# EasyEDA schematic SCH_Base-robot_2026-06-25.json

## Sheets
1 Base Roulante: TITLE: Sheet_1; REV: 1.0; Date: 2026-06-23; Sheet: 1/1; Company: Your Company
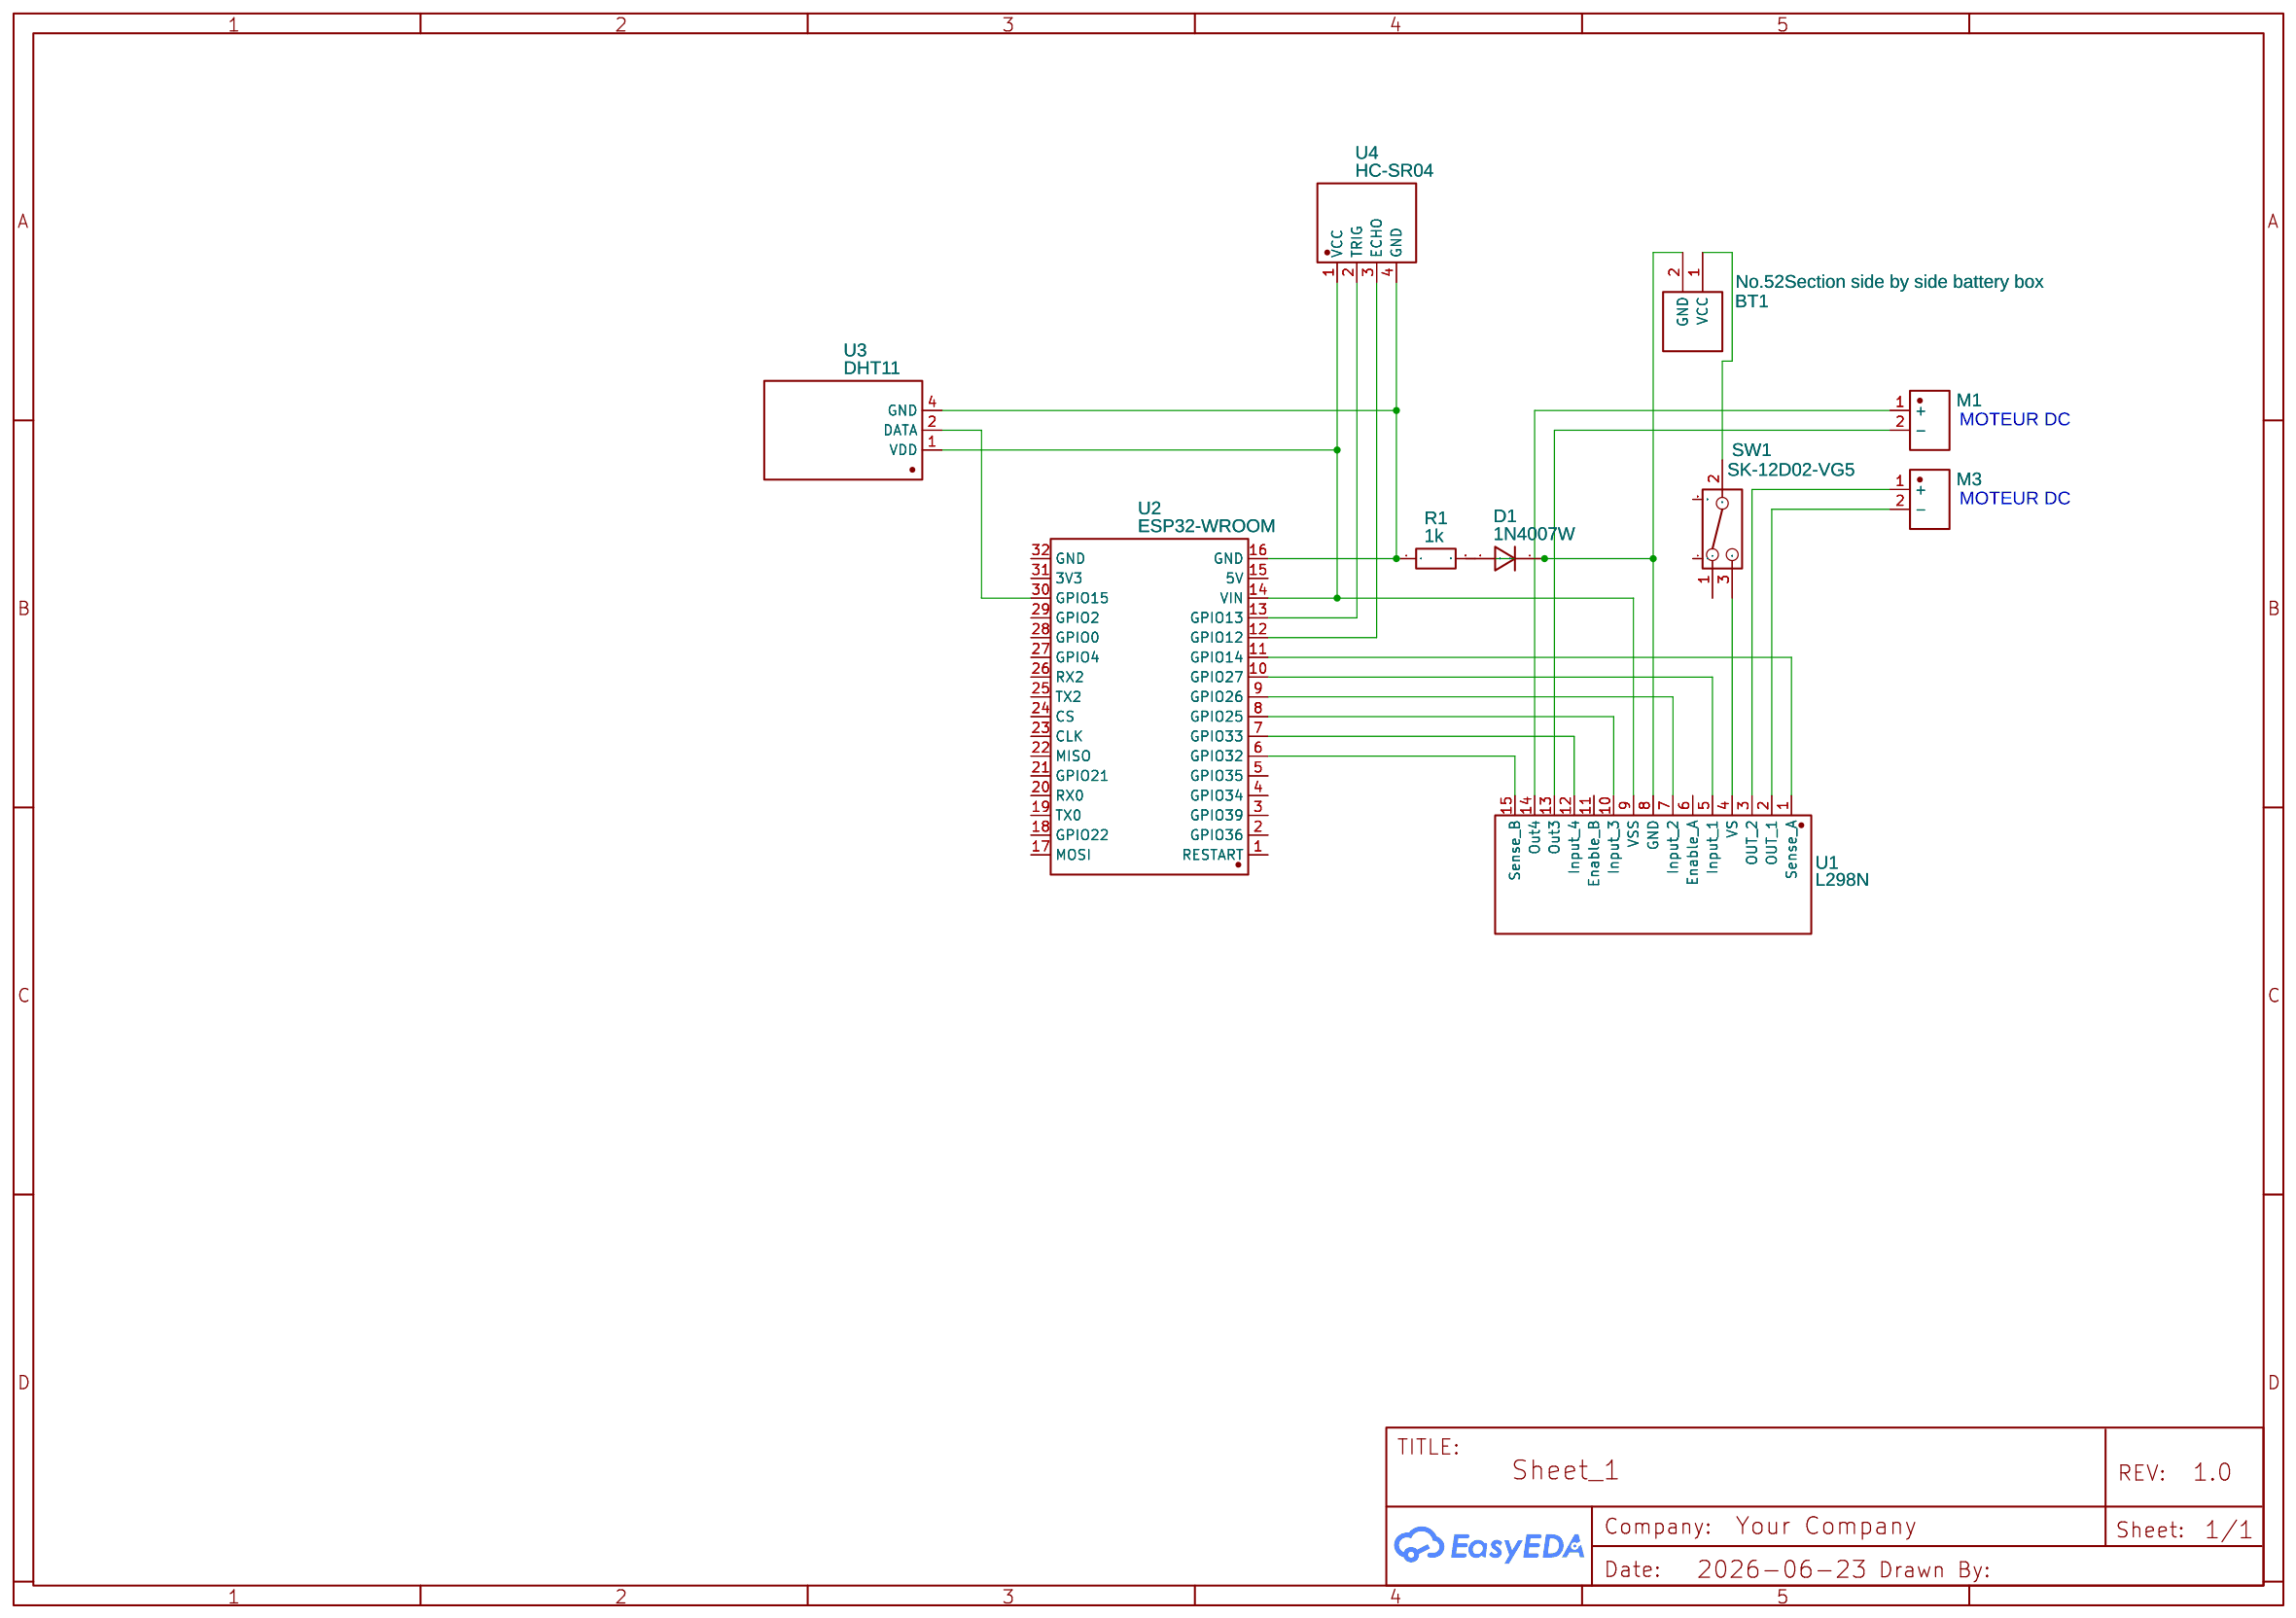
[diagram p0: Base Roulante]
2 Manette: TITLE: Sheet_2; Date: 2026-06-25; Drawn By: yanisynov
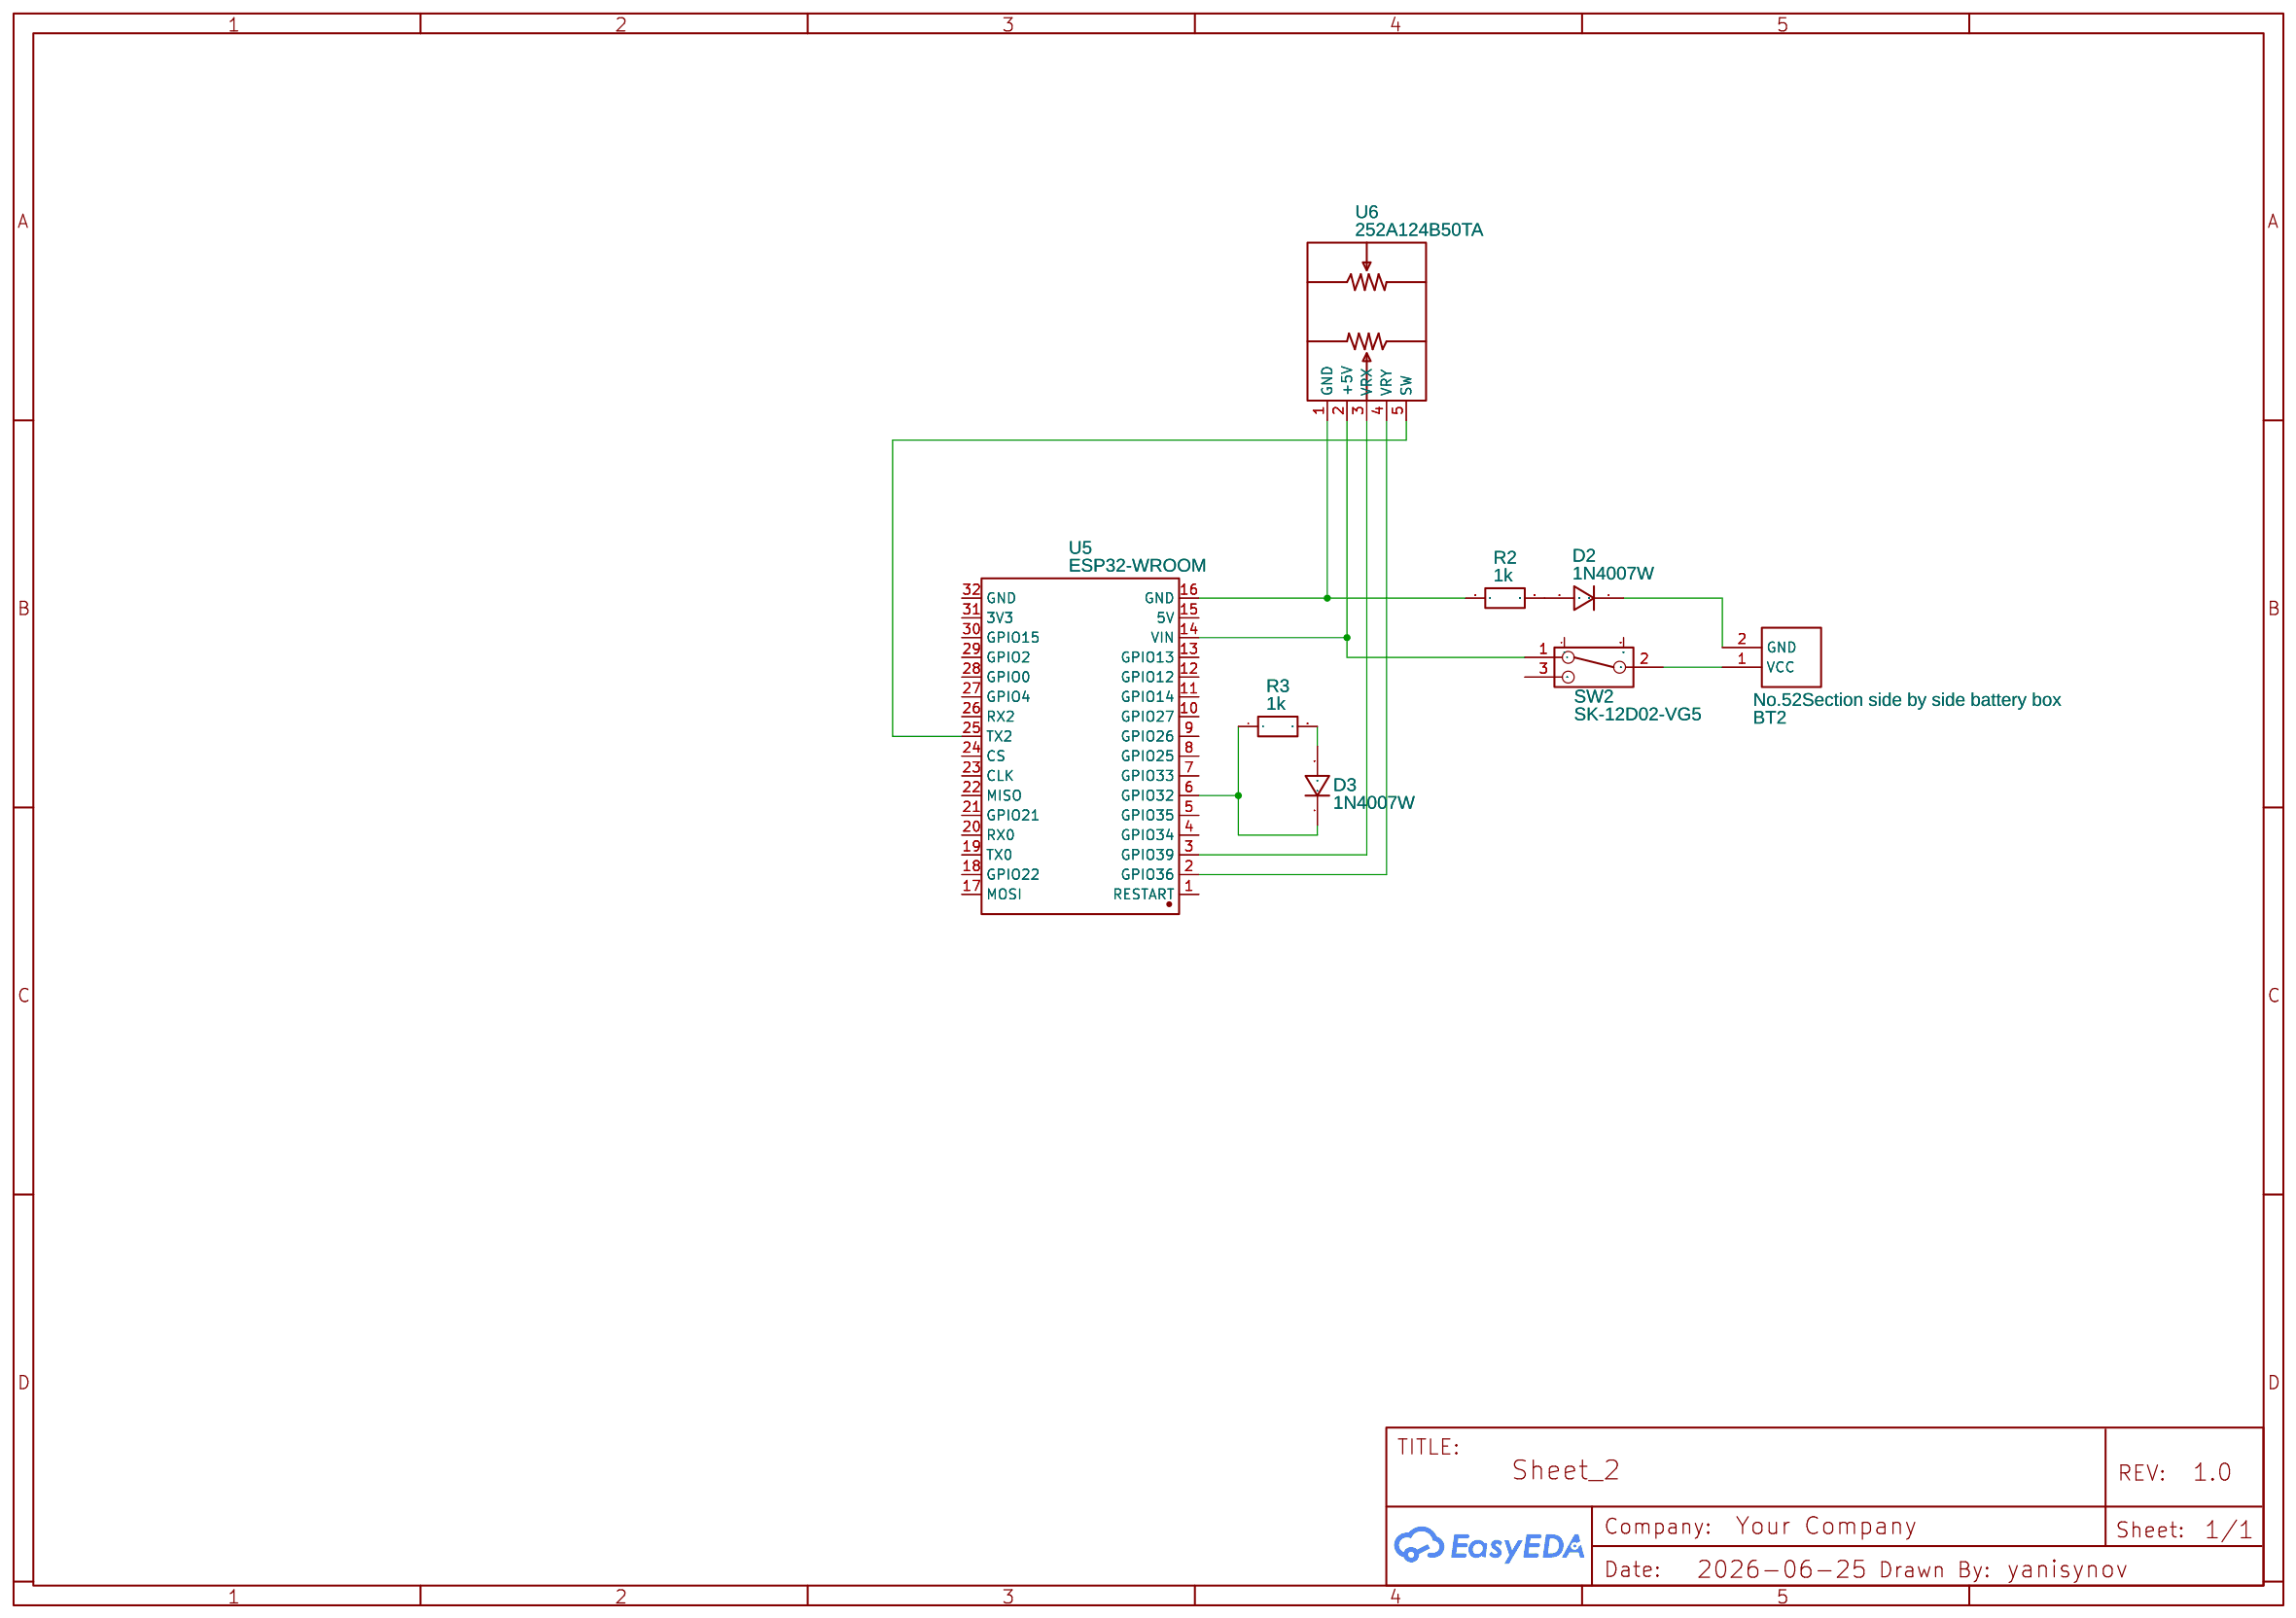
[diagram p1: Manette]

## Parts
sheet Base Roulante
BT1  No.52Section side by side battery box  [BAT-TH_BC2AA]
D1  1N4007W  [SOD-123_L2.8-W1.8-LS3.7-RD]
M1  MOTEUR DC  [MOTOR-SMD_Z4TH3B0791626]
M3  MOTEUR DC  [MOTOR-SMD_Z4TH3B0791626]
R1  1k  [R0603]
SW1  SK-12D02-VG5  [SW-TH_SK-12D02VG3]
U1  L298N  [MULTIWATT-15_L19.6-W5.0-P1.27-L]
U2  ESP32-WROOM  [WIFI-SMD_ESP32-WROOM-32UE]
U3  DHT11  [SENSOR-TH_DHT11]
U4  HC-SR04  [TH_HC-SR04V]
sheet Manette
BT2  No.52Section side by side battery box  [BAT-TH_BC2AA]
D2  1N4007W  [SOD-123_L2.8-W1.8-LS3.7-RD]
D3  1N4007W  [SOD-123_L2.8-W1.8-LS3.7-RD]
R2  1k  [R0603]
R3  1k  [R0603]
SW2  SK-12D02-VG5  [SW-TH_SK-12D02VG3]
U5  ESP32-WROOM  [WIFI-SMD_ESP32-WROOM-32UE]
U6  252A124B50TA  [JOYSTICK-TH_252BXXXXXXXA]

## Library data of the parts
BT1 BT2 = No.52Section side by side battery box: Supplier: LCSC; Manufacturer: 国产; Manufacturer Part: 五号2节并列电池盒; Supplier Part: C5404; JLCPCB Part Class: Extended Part
D1-D3 = 1N4007W: Supplier: LCSC; Supplier Part: C328592; Manufacturer: BLUE ROCKET; Contributor: LCEDA_Lib
M1 M3 = Z4TH3B0791626: Supplier: LCSC; Supplier Part: C2836756; Manufacturer: KOTL(金龙机电); JLCPCB Part Class: Extended Part; Contributor: lcsc
R1-R3 = R_0603_EU: Contributor: LCEDA_Lib
SW1 SW2 = SK-12D02-VG5: Supplier: LCSC; Supplier Part: C136722; Manufacturer: Rectangular Connectors - Contacts; Contributor: LCSC
U1 = L298N: Contributor: LCSC; Supplier: LCSC; Supplier Part: C434589; Manufacturer: HGSEMI(华冠); JLCPCB Part Class: Extended Part
U2 U5 = ESP32-WROOM: Contributor: lcsc; Supplier: LCSC; Supplier Part: C2973674; Manufacturer: null; Manufacturer Part: ESP32-WROOM-32U(16MB); JLCPCB Part Class: Extended Part
U3 = DHT11: Contributor: LCSC; Supplier: LCSC; Supplier Part: C117051; Manufacturer: 广州奥松; JLCPCB Part Class: Extended Part
U4 = HC-SR04: Supplier: LCSC; Supplier Part: C19857336; Manufacturer: Universal Microelectronics; Contributor: lcsc; JLCPCB Part Class: Extended Part
U6 = 252A124B50TA: Supplier: LCSC; Supplier Part: C19444785; Manufacturer: CTS(西迪斯); Contributor: lcsc; JLCPCB Part Class: Extended Part

## Nets
Net-(BT1-1): BT1.1(VCC) SW1.2
Net-(BT1-2): BT1.2(GND) D1.1 R1.2 U1.8(GND)
Net-(BT2-1): BT2.1(VCC) SW2.2
Net-(BT2-2): BT2.2(GND) D2.1
Net-(D2-2): D2.2 R2.2
Net-(D3-1): D3.1 R3.1 U5.6(GPIO32)
Net-(D3-2): D3.2 R3.2
Net-(M1-1): M1.1(+) U1.14(Out4)
Net-(M1-2): M1.2(-) U1.13(Out3)
Net-(M3-1): M3.1(+) U1.3(OUT 2)
Net-(M3-2): M3.2(-) U1.2(OUT 1)
Net-(R1-1): R1.1 U2.16(GND) U3.4(GND) U4.4(GND)
Net-(R2-1): R2.1 U5.16(GND) U6.1(GND)
Net-(SW1-3): SW1.3 U1.4(VS)
Net-(SW2-1): SW2.1 U5.14(VIN) U6.2(+5V)
Net-(U1-1): U1.1(Sense A) U2.11(GPIO14)
Net-(U1-5): U1.5(Input 1) U2.10(GPIO27)
Net-(U1-7): U1.7(Input 2) U2.9(GPIO26)
Net-(U1-9): U1.9(VSS) U2.14(VIN) U3.1(VDD) U4.1(VCC)
Net-(U1-10): U1.10(Input 3) U2.8(GPIO25)
Net-(U1-12): U1.12(Input 4) U2.7(GPIO33)
Net-(U1-15): U1.15(Sense B) U2.6(GPIO32)
Net-(U2-12): U2.12(GPIO12) U4.3(ECHO)
Net-(U2-13): U2.13(GPIO13) U4.2(TRIG)
Net-(U2-30): U2.30(GPIO15) U3.2(DATA)
Net-(U5-2): U5.2(GPIO36) U6.4(VRY)
Net-(U5-3): U5.3(GPIO39) U6.3(VRX)
Net-(U5-25): U5.25(TX2) U6.5(SW)

Not connected (* = marked no-connect by the designer): D1 2; SW1 1 4 5; SW2 3 4 5; U1 6(Enable A) 11(Enable B); U2 1(RESTART) 2(GPIO36) 3(GPIO39) 4(GPIO34) 5(GPIO35) 15(5V) 17(MOSI) 18(GPIO22) 19(TX0) 20(RX0) 21(GPIO21) 22(MISO) 23(CLK) 24(CS) 25(TX2) 26(RX2) 27(GPIO4) 28(GPIO0) 29(GPIO2) 31(3V3) 32(GND); U5 1(RESTART) 4(GPIO34) 5(GPIO35) 7(GPIO33) 8(GPIO25) 9(GPIO26) 10(GPIO27) 11(GPIO14) 12(GPIO12) 13(GPIO13) 15(5V) 17(MOSI) 18(GPIO22) 19(TX0) 20(RX0) 21(GPIO21) 22(MISO) 23(CLK) 24(CS) 26(RX2) 27(GPIO4) 28(GPIO0) 29(GPIO2) 30(GPIO15) 31(3V3) 32(GND)

## Notes on the sheets
sheet 1
- MOTEUR DC
- MOTEUR DC
